# EAGLE design BATTERIES_CONTROLLER (EAGLE 9.0.0)
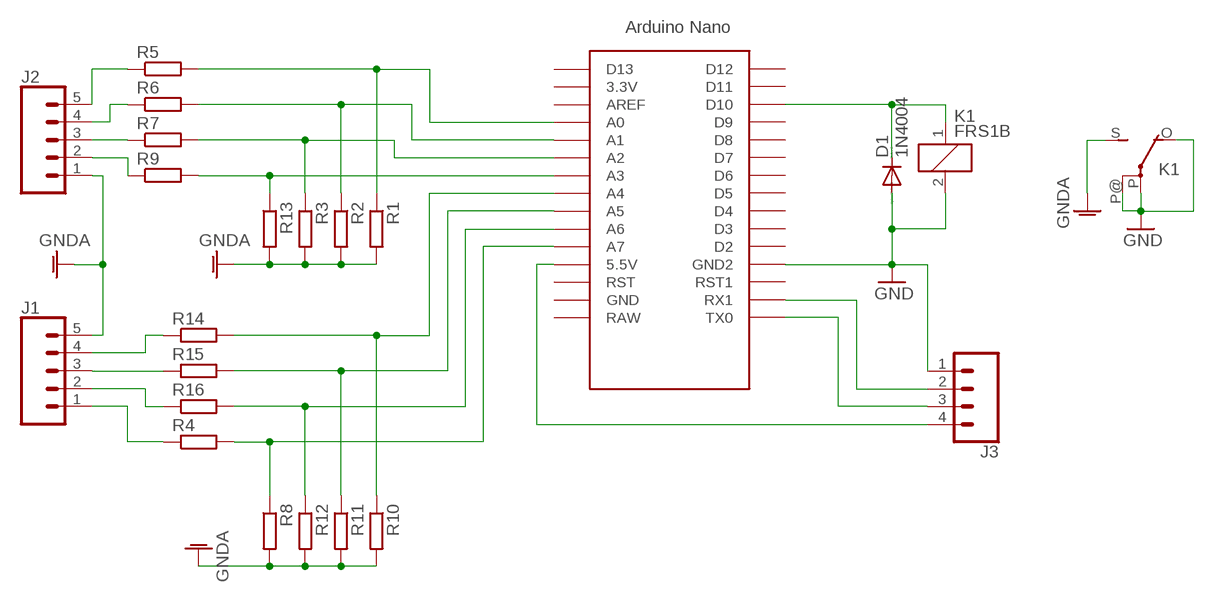
[diagram p0: schematic, sheet 1]

## Parts
D1  1N4004  [DO41-10]
J1  CONN_05  [1X05]
J2  CONN_05  [1X05]
J3  CONN_04  [1X04]
K1  FRS1B  [FRS1B]
R1  R-EU_M0805  [M0805]
R2  R-EU_M0805  [M0805]
R3  R-EU_M0805  [M0805]
R4  R-EU_M0805  [M0805]
R5  R-EU_M0805  [M0805]
R6  R-EU_M0805  [M0805]
R7  R-EU_M0805  [M0805]
R8  R-EU_M0805  [M0805]
R9  R-EU_M0805  [M0805]
R10  R-EU_M0805  [M0805]
R11  R-EU_M0805  [M0805]
R12  R-EU_M0805  [M0805]
R13  R-EU_M0805  [M0805]
R14  R-EU_M0805  [M0805]
R15  R-EU_M0805  [M0805]
R16  R-EU_M0805  [M0805]
U$1  NANO  [NANO]

## Nets
GND: D1.A J3.1 K1.2 K1.O(2:O) K1.P(2:P) K1.P@(2:P) U$1.GND1(GND2)
GNDA: J1.5 J2.1 K1.S(2:S) R1.2 R2.2 R3.2 R8.2 R10.2 R11.2 R12.2 R13.2
N$1: R1.1 R5.2 U$1.A0
N$2: R2.1 R6.2 U$1.A1
N$3: R3.1 R7.2 U$1.A2
N$4: R4.2 R8.1 U$1.A7
N$5: J2.5 R5.1
N$6: J2.4 R6.1
N$7: J2.3 R7.1
N$8: D1.C K1.1 U$1.D10
N$9: J1.1 R4.1
N$10: R10.1 R14.2 U$1.A4
N$11: R11.1 R15.2 U$1.A5
N$12: R12.1 R16.2 U$1.A6
N$13: R9.2 R13.1 U$1.A3
N$14: J1.4 R14.1
N$15: J1.3 R15.1
N$16: J1.2 R16.1
N$17: J2.2 R9.1
N$18: J3.2 U$1.RX1
N$19: J3.3 U$1.TX0
N$20: J3.4 U$1.5V(5.5V)
Unconnected: U$1.3.3V U$1.AREF U$1.D2 U$1.D3 U$1.D4 U$1.D5 U$1.D6 U$1.D7 U$1.D8 U$1.D9 U$1.D11 U$1.D12 U$1.D13 U$1.GND U$1.ICSP1 U$1.ICSP2 U$1.ICSP3 U$1.ICSP4 U$1.ICSP5 U$1.ICSP6 U$1.RAW U$1.RST U$1.RST1

## Library data of the parts
D1 = diode:1N4004: DIODE general purpose rectifier, 1 A
J1 J2 = SparkFun-Connectors:CONN_05: Multi connection point. Often used as Generic Header-pin footprint for 0.1 inch spaced/style header connections On any of the 0.1 inch spaced packages, you can populate with these: Break Away Headers - Straight <https://www.sparkfun.com/products/116> (PRT-00116) Break Away Male Headers - Right Angle <https://www.sparkfun.com/products/553> (PRT-00553) Female Headers <https://www.sparkfun.com/products/115> (PRT-00115) Break Away Headers - Machine Pin <https://www.sparkfun.com/products/117> (PRT-00117) Break Away Female Headers - Swiss Machine Pin <https://www.sparkfun.com/products/743> (PRT-00743) For SCREWTERMINALS and SPRING TERMINALS visit here: Screw Terimnals on SparkFun.com <https://www.sparkfun.com/search/results?term=Screw+Terminals> (5mm/3.5mm/2.54mm spacing) This device is also useful as a general connection point to wire up your design to another part of your project. Our various solder wires solder well into these plated through hole pads. Hook-Up Wire - Assortment (Stranded, 22 AWG) <https://www.sparkfun.com/products/11375> (PRT-11375) Hook-Up Wire - Assortment (Solid Core, 22 AWG) <https://www.sparkfun.com/products/11367> (PRT-11367) View the entire wire category on our website here <https://www.sparkfun.com/categories/141> Special notes: Molex polarized connector foot print use with SKU : PRT-08231 with associated crimp pins and housings. 1MM SMD Version SKU: PRT-10208
J3 = SparkFun-Connectors:CONN_04: Multi connection point. Often used as Generic Header-pin footprint for 0.1 inch spaced/style header connections On any of the 0.1 inch spaced packages, you can populate with these: Break Away Headers - Straight <https://www.sparkfun.com/products/116> (PRT-00116) Break Away Male Headers - Right Angle <https://www.sparkfun.com/products/553> (PRT-00553) Female Headers <https://www.sparkfun.com/products/115> (PRT-00115) Break Away Headers - Machine Pin <https://www.sparkfun.com/products/117> (PRT-00117) Break Away Female Headers - Swiss Machine Pin <https://www.sparkfun.com/products/743> (PRT-00743) For SCREWTERMINALS and SPRING TERMINALS visit here: Screw Terimnals on SparkFun.com <https://www.sparkfun.com/search/results?term=Screw+Terminals> (5mm/3.5mm/2.54mm spacing) This device is also useful as a general connection point to wire up your design to another part of your project. Our various solder wires solder well into these plated through hole pads. Hook-Up Wire - Assortment (Stranded, 22 AWG) <https://www.sparkfun.com/products/11375> (PRT-11375) Hook-Up Wire - Assortment (Solid Core, 22 AWG) <https://www.sparkfun.com/products/11367> (PRT-11367) View the entire wire category on our website here <https://www.sparkfun.com/categories/141> Special notes: Molex polarized connector foot print use with SKU : PRT-08231 with associated crimp pins and housings. 1MM SMD Version SKU: PRT-10208; PROD_ID: CONN-09696
K1 = relay:FRS1B: RELAY 1 x switch, same as V23101-D6-A201, Siemens; OC_FARNELL: unknown; OC_NEWARK: unknown
R1-R16 = resistor:R-EU_: RESISTOR, European symbol
U$1 = Arduino-clone:NANO: Arduino Nano

## Board
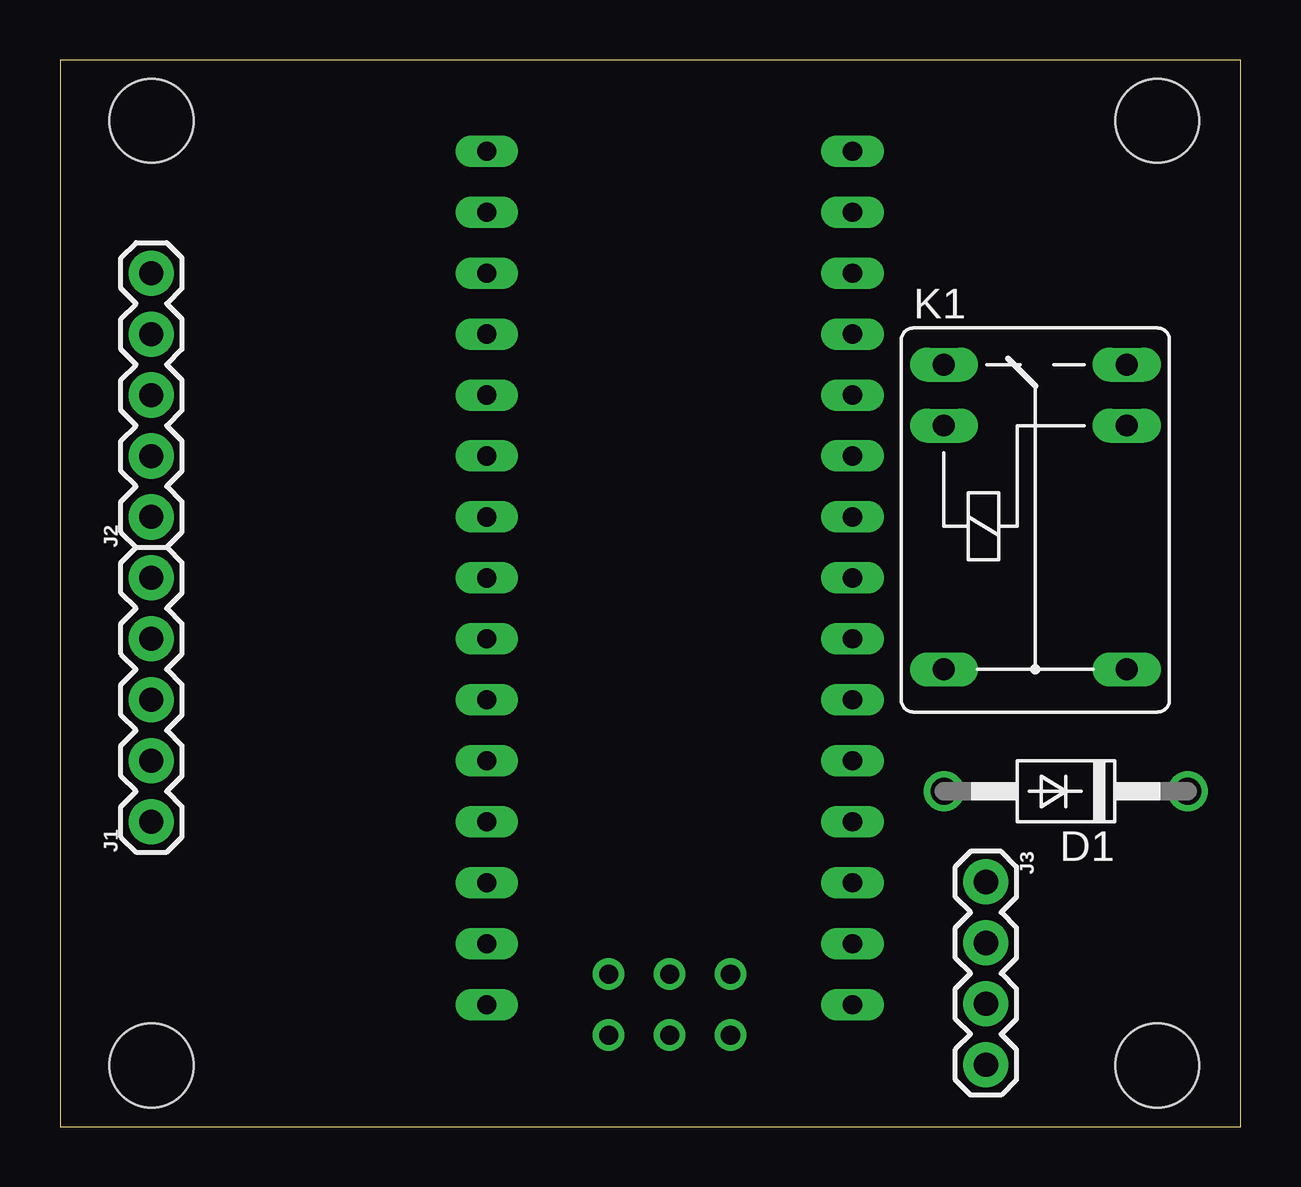
[diagram p1: board, top side]
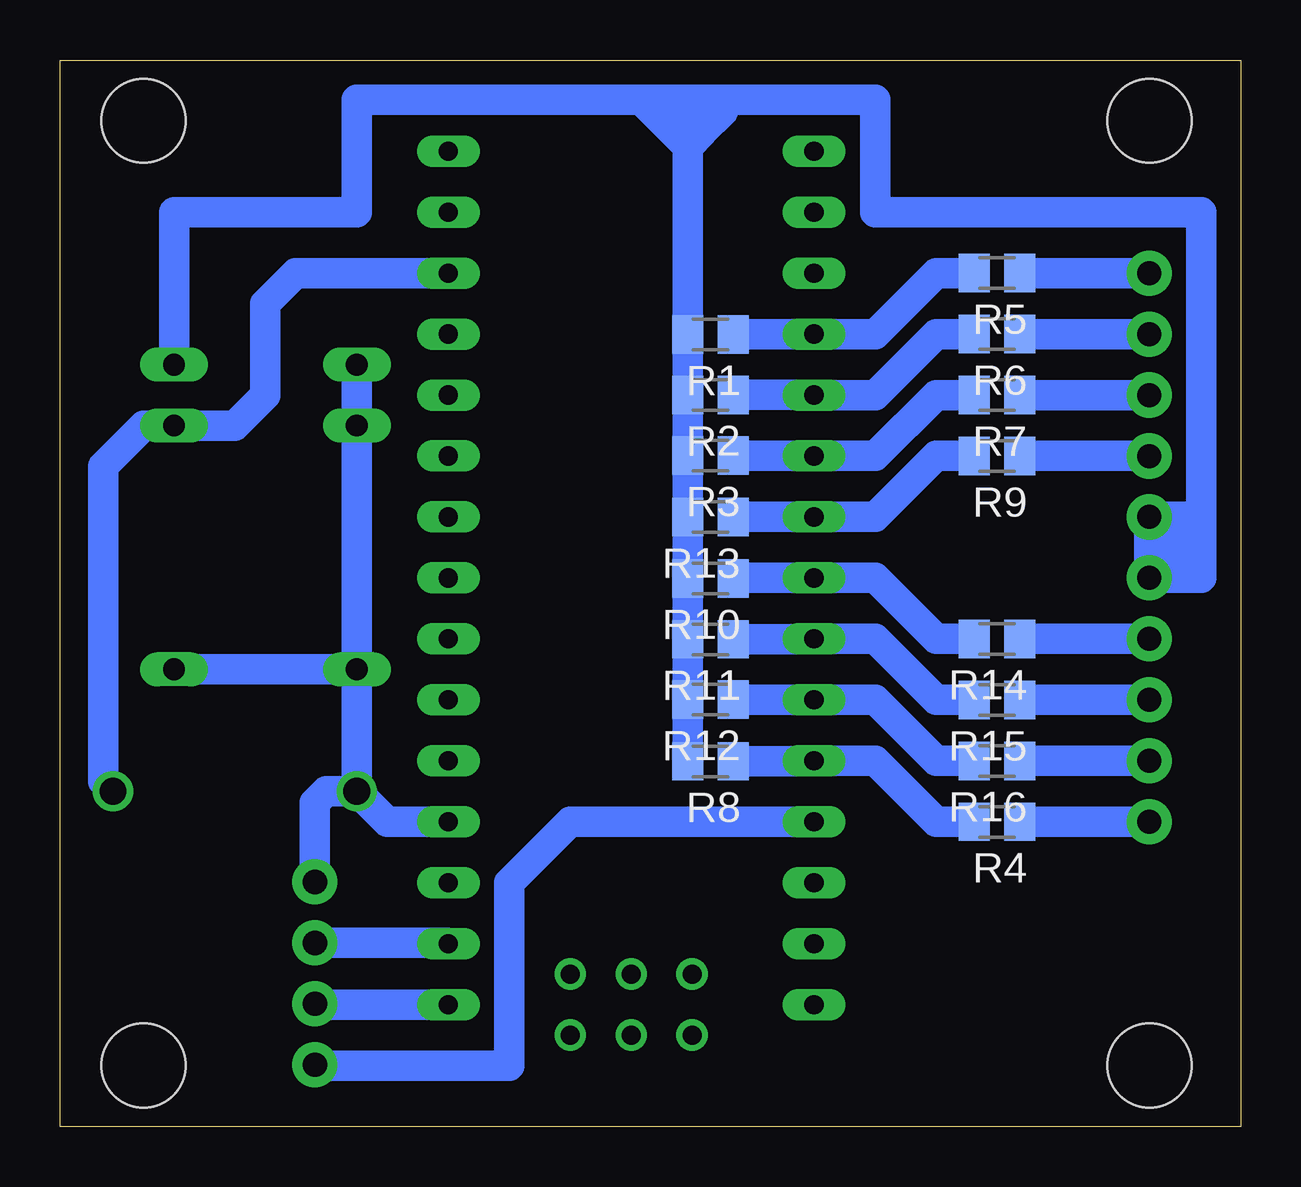
[diagram p2: board, bottom side, seen from below]

Size 49.2 x 44.44 mm. Coordinates in mm from the lower left corner, seen from the top.
Outline: 0,0 49.2,0 49.2,44.44 0,44.44 0,0
Copper layers (1*16): Top 0.035mm / dielectric 1.5mm / Bottom 0.035mm
Design rules "default": minimum track width 6mil, minimum drill 0.35mm, track to track 6mil, track to pad 6mil, pad to pad 6mil, via to via 6mil, smd to smd 6mil, copper to edge 40mil, drill to drill 6mil, minimum pad ring 10mil, minimum via ring 8mil, stop-mask expansion 4mil, vias tented up to drill 0mil, thermal gap 10mil
Holes 3.5 mm at 3.81,41.91 3.81,2.54 45.72,2.54 45.72,41.91

### Footprints (pad centres in the part's own frame; a part is rotated, then mirrored left to right if it is on the bottom)
DO41-10 = drill 1.118: A 5.08,0; C -5.08,0
1X05 = drill 1 pad 1.88: 1 0,0; 2 2.54,0; 3 5.08,0; 4 7.62,0; 5 10.16,0
1X04 = drill 1.016 pad 1.88: 1 0,0; 2 2.54,0; 3 5.08,0; 4 7.62,0
FRS1B = drill 0.914 long: 1 0,3.81; 2 0,-3.81; O -2.54,-3.81; P 10.16,3.81; P@ 10.16,-3.81; S -2.54,3.81
M0805 = smd 1.3 x 1.6: 1 -0.95,0; 2 0.95,0
NANO = drill 0.8 long: 3.3V -10.16,24.13; 5V -10.16,-1.27; A0 -10.16,19.05; A1 -10.16,16.51; A2 -10.16,13.97; A3 -10.16,11.43; A4 -10.16,8.89; A5 -10.16,6.35; A6 -10.16,3.81; A7 -10.16,1.27; AREF -10.16,21.59; D2 5.08,1.27; D3 5.08,3.81; D4 5.08,6.35; D5 5.08,8.89; D6 5.08,11.43; D7 5.08,13.97; D8 5.08,16.51; D9 5.08,19.05; D10 5.08,21.59; D11 5.08,24.13; D12 5.08,26.67; D13 -10.16,26.67; GND -10.16,-6.35; GND1 5.08,-1.27; RAW -10.16,-8.89; RST -10.16,-3.81; RST1 5.08,-3.81; RX1 5.08,-6.35; TX0 5.08,-8.89 | drill 0.8: ICSP1 -5.08,-10.16; ICSP2 -5.08,-7.62; ICSP3 -2.54,-10.16; ICSP4 -2.54,-7.62; ICSP5 0,-10.16; ICSP6 0,-7.62

### Placement (x,y rotation side)
D1  41.91,13.97 180 top
J1  3.81,12.7 90 top
J2  3.81,25.4 90 top
J3  38.58,10.2 270 top
K1  40.64,29.21 270 top
R1  22.1,33 180 bottom
R2  22.1,30.48 180 bottom
R3  22.1,27.96 180 bottom
R4  10.16,12.7 180 bottom
R5  10.16,35.56 180 bottom
R6  10.16,33.02 180 bottom
R7  10.16,30.48 180 bottom
R8  22.1,15.22 180 bottom
R9  10.16,27.94 180 bottom
R10  22.1,22.84 180 bottom
R11  22.1,20.3 180 bottom
R12  22.1,17.79 180 bottom
R13  22.1,25.39 180 bottom
R14  10.16,20.32 180 bottom
R15  10.16,17.78 180 bottom
R16  10.16,15.24 180 bottom
U$1  27.94,13.97 0 top

### Tracks (layer width: path | path; a pad name or v marks a point on that pad's centre or on a via)
GND
  Bottom 1.27: K1.O K1.2 K1.P@ | K1.P K1.P@ | K1.P@ D1.A | D1.A 35.56,12.7 U$1.GND1 | J3.1 38.58,13.49 38.1,13.97 D1.A
GNDA
  Bottom 1.27: R8.2 R12.2 R11.2 R10.2 R13.2 R3.2 R2.2 R1.2 23.05,40.83 | K1.S 44.45,38.1 36.83,38.1 36.83,42.79 25.01,42.79 | 23.05,40.83 23.5,41.27 | 23.5,41.27 25.01,42.79 | J1.5 J2.1 2.54,25.4 | 2.54,25.4 1.65,25.4 | 1.65,25.4 1.65,38.1 15.24,38.1 15.24,42.79 21.59,42.79 | 21.59,42.79 22.86,42.79 | 22.86,42.79 25.01,42.79 | 23.05,40.83 22.41,41.46 | 22.41,41.46 21.59,42.28 21.59,42.79 | 22.41,41.46 22.41,42.34 22.86,42.79 | 22.86,42.79 22.86,41.91 23.5,41.27 | 2.54,22.86 1.65,22.86 1.65,25.4 | 2.54,22.86 J1.5 | J1.5 3.81,24.13 3.17,24.77 | 3.17,24.77 2.54,25.4 | 2.54,22.86 2.54,24.13 3.17,24.77
N$1
  Bottom 1.27: R1.1 21.13,33.02 U$1.A0 15.24,33.02 12.7,35.56 R5.2
N$2
  Bottom 1.27: R2.1 U$1.A1 15.24,30.48 12.7,33.02 R6.2
N$3
  Bottom 1.27: R3.1 21.12,27.94 U$1.A2 15.24,27.94 12.7,30.48 R7.2
N$4
  Bottom 1.27: R8.1 17.8,15.22 U$1.A7 15.24,15.24 12.7,12.7 R4.2
N$5
  Bottom 1.27: J2.5 R5.1
N$6
  Bottom 1.27: R6.1 J2.4
N$7
  Bottom 1.27: J2.3 R7.1
N$8
  Bottom 1.27: D1.C 47.4,14.38 47.4,27.52 45.71,29.21 K1.1 41.91,29.21 40.64,30.48 40.64,34.29 39.37,35.56 U$1.D10
N$9
  Bottom 1.27: J1.1 R4.1
N$10
  Bottom 1.27: R10.1 21.13,22.86 U$1.A4 15.24,22.86 12.7,20.32 R14.2
N$11
  Bottom 1.27: R11.1 17.8,20.3 U$1.A5 15.24,20.32 12.7,17.78 R15.2
N$12
  Bottom 1.27: R12.1 21.14,17.78 U$1.A6 15.24,17.78 12.7,15.24 R16.2
N$13
  Bottom 1.27: R13.1 21.14,25.4 U$1.A3 15.24,25.4 12.7,27.94 R9.2
N$14
  Bottom 1.27: J1.4 R14.1
N$15
  Bottom 1.27: R15.1 J1.3
N$16
  Bottom 1.27: J1.2 R16.1
N$17
  Bottom 1.27: R9.1 J2.2
N$18
  Bottom 1.27: U$1.RX1 33.06,7.66 J3.2
N$19
  Bottom 1.27: J3.3 38.54,5.08 U$1.TX0
N$20
  Bottom 1.27: J3.4 38.54,2.54 30.48,2.54 30.48,10.16 27.94,12.7 U$1.5V